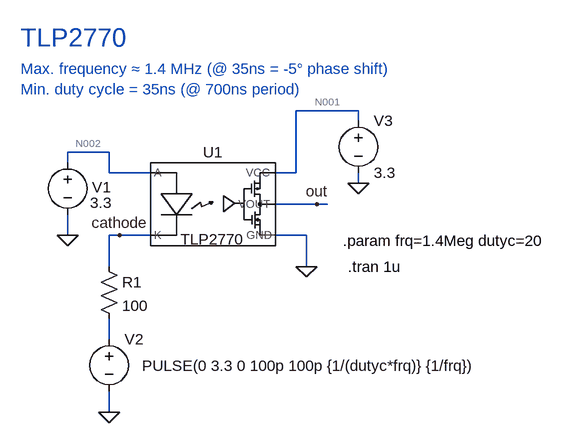
[diagram p0: schematic 01-tlp2770.asc]
01-tlp2770.asc, the LTspice schematic file:
Version 4
SHEET 1 880 680
WIRE 480 16 384 16
WIRE 480 32 480 16
WIRE 96 80 32 80
WIRE 32 96 32 80
WIRE 96 112 96 80
WIRE 160 112 96 112
WIRE 384 112 384 16
WIRE 384 112 352 112
WIRE 480 128 480 112
WIRE 416 160 352 160
WIRE 432 160 416 160
WIRE 32 208 32 176
WIRE 112 208 96 208
WIRE 160 208 112 208
WIRE 400 208 352 208
WIRE 96 256 96 208
WIRE 400 256 400 208
WIRE 96 368 96 336
WIRE 96 480 96 448
FLAG 32 208 0
FLAG 96 480 0
FLAG 416 160 out
FLAG 400 256 0
FLAG 480 128 0
FLAG 112 208 cathode
SYMBOL res 80 240 R0
SYMATTR InstName R1
SYMATTR Value 100
SYMBOL voltage 32 80 R0
WINDOW 0 38 54 Left 2
WINDOW 3 35 78 Left 2
WINDOW 123 0 0 Left 0
WINDOW 39 0 0 Left 0
SYMATTR InstName V1
SYMATTR Value 3.3
SYMBOL voltage 96 352 R0
WINDOW 123 0 0 Left 0
WINDOW 39 0 0 Left 0
WINDOW 3 51 57 Left 2
SYMATTR InstName V2
SYMATTR Value PULSE(0 3.3 0 100p 100p {1/(dutyc*frq)} {1/frq})
SYMBOL voltage 480 16 R0
WINDOW 123 0 0 Left 0
WINDOW 39 0 0 Left 0
SYMATTR InstName V3
SYMATTR Value 3.3
SYMBOL TLP2770 256 160 R0
SYMATTR InstName U1
TEXT 456 216 Left 2 !.param frq=1.4Meg dutyc=20
TEXT 464 256 Left 2 !.tran 1u
TEXT -40 -48 Left 2 ;Max. frequency ≈ 1.4 MHz (@ 35ns = -5° phase shift)\nMin. duty cycle = 35ns (@ 700ns period)
TEXT -40 -96 Left 4 ;TLP2770

The netlist it stands for:
* 01-tlp2770.asc
R1 cathode N003 100
V1 N002 0 3.3
V2 N003 0 PULSE(0 3.3 0 100p 100p {1/(dutyc*frq)} {1/frq})
V3 N001 0 3.3
XU1 N002 cathode 0 out N001 TLP2770  ; pins A K GND VOUT VCC
.param frq=1.4Meg dutyc=20
.tran 1u
* Max. frequency ≈ 1.4 MHz (@ 35ns = -5° phase shift)
* Min. duty cycle = 35ns (@ 700ns period)
* TLP2770
.lib C:\Users\hop\Documents\GitHub\LTspice\01-lib\TLP2770.mod
.backanno
.end

* Results of the author's LTspice run, read from the files saved beside the schematic
* Operating Point, zero values left out:
*   V(cathode) = 1.447 V
*   V(n002) = 3.3 V
*   V(n001) = 3.3 V
*   V(out) = 3.3 V
*   I(R1) = 14.47 mA
*   I(V1) = -14.47 mA
*   I(V2) = 14.47 mA
*   I(V3) = 88.16 µA
*   Ix(u1:1) = 14.47 mA
*   Ix(u1:3) = -14.47 mA
*   Ix(u1:4) = 88.16 µA
*   Ix(u1:6) = -88.16 µA
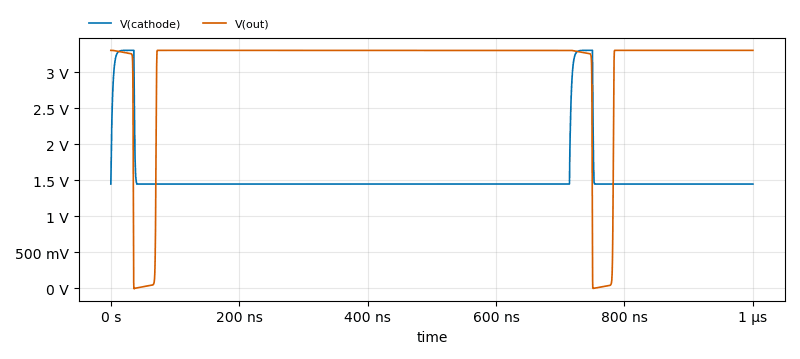
[diagram p1: Transient Analysis of 01-tlp2770.asc, plotted from the saved traces]
* Transient Analysis, 1 run:
*   V(cathode): min 1.446 V, max 3.3 V, average 1.574 V, rms 1.639 V, last 1.447 V
*   V(out): min -5.881 mV, max 3.3 V, average 3.075 V, rms 3.181 V, last 3.3 V